# Altium schematic sheet projet_overview.SchDoc
size A4; SheetNumber: 1; SheetTotal: 12
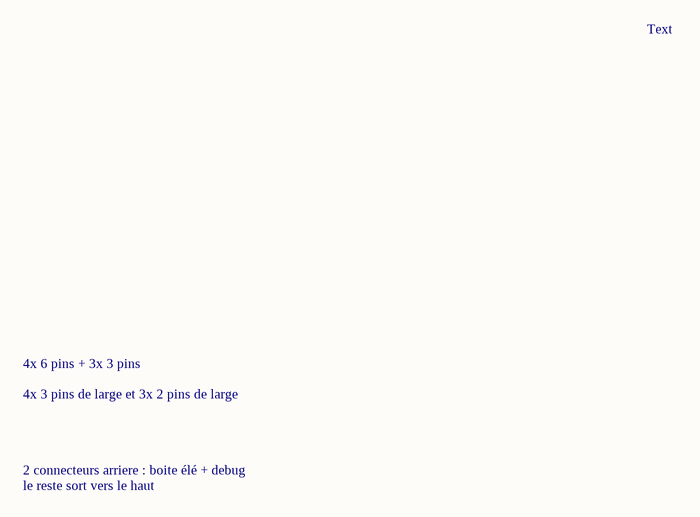
[diagram p0: projet_overview.SchDoc]

## Notes on the sheet
- Text
- 4x 6 pins + 3x 3 pins
- 4x 3 pins de large et 3x 2 pins de large
- 2 connecteurs arriere : boite élé + debug
- le reste sort vers le haut